# EAGLE design INA260_TB (EAGLE 8.0.0)
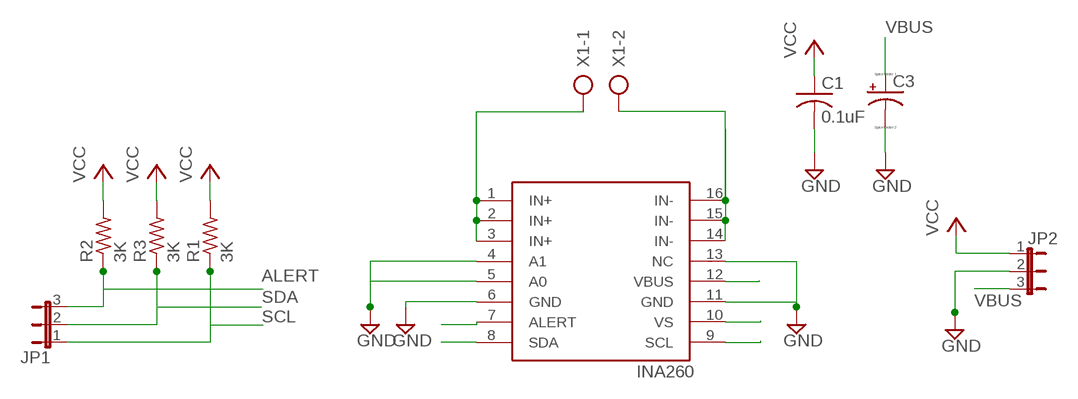
[diagram p0: schematic, sheet 1]

## Parts
C1  0.1uF  C-US050-025X075  [C050-025X075]
C3  CPOL-USE5-10.5  [E5-10,5]
JP1  JP2E  [JP2]
JP2  JP2E  [JP2]
R1  3K  R-US_0207/10  [0207/10]
R2  3K  R-US_0207/10  [0207/10]
R3  3K  R-US_0207/10  [0207/10]
U$1  INA260  [TSSOP16]
X1  AK300/2  [AK300/2]

## Nets
ALERT: JP1.3 R2.1 U$1.7(ALERT)
GND: C1.2 C3.- JP2.2 U$1.4(A1) U$1.5(A0) U$1.6(GND) U$1.11(GND) U$1.13(NC)
N$1: U$1.1(IN+) U$1.2(IN+) U$1.3(IN+) X1.1
N$2: U$1.14(IN-) U$1.15(IN-) U$1.16(IN-) X1.2
SCL: JP1.1 R1.1 U$1.9(SCL)
SDA: JP1.2 R3.1 U$1.8(SDA)
VBUS: C3.+ JP2.3 U$1.12(VBUS)
VCC: C1.1 JP2.1 R1.2 R2.2 R3.2 U$1.10(VS)

## Library data of the parts
C1 = resistor:C-US: CAPACITOR, American symbol
C3 = resistor:CPOL-US: POLARIZED CAPACITOR, American symbol
JP1 JP2 = jumper:JP2E: JUMPER
R1-R3 = rcl:R-US_: RESISTOR, American symbol
U$1 = INA260:INA260: High/Low-Side Digital Current/Power Monitor with Integrated 2mΩ Shunt Resistor http://www.ti.com/product/INA260/description; MANUFACTURER: Texas Instruments
X1 = con-ptr500:AK300/2: CONNECTOR; OC_FARNELL: unknown; OC_NEWARK: unknown

## Net classes
0 default: width 0.406 mm, drill 0.762 mm, clearance 0.406 mm

## Board
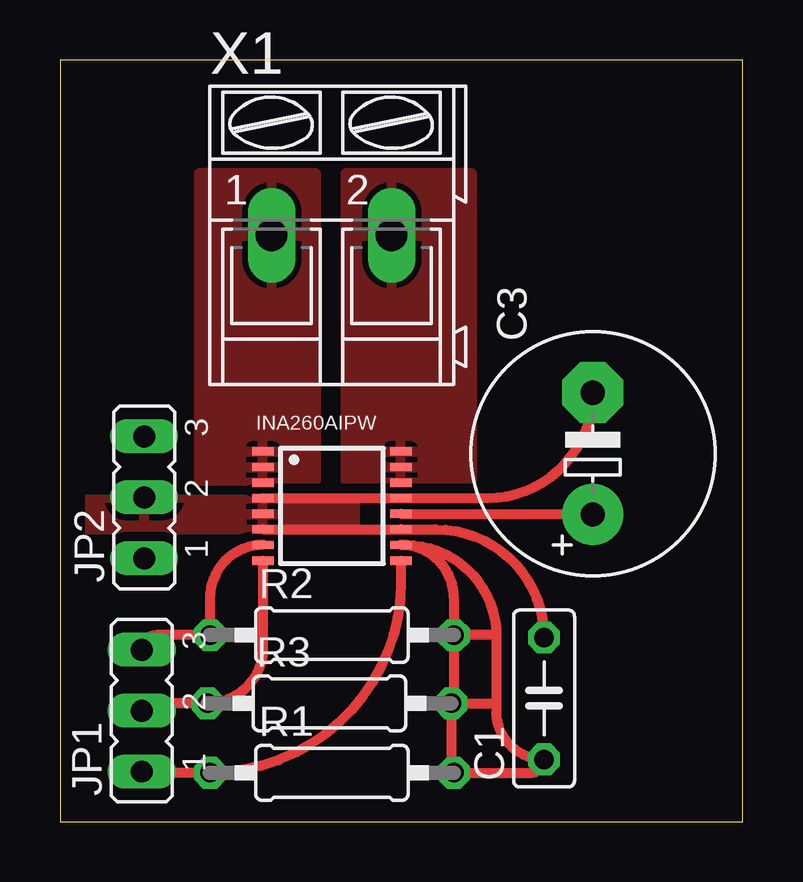
[diagram p1: board, top side]
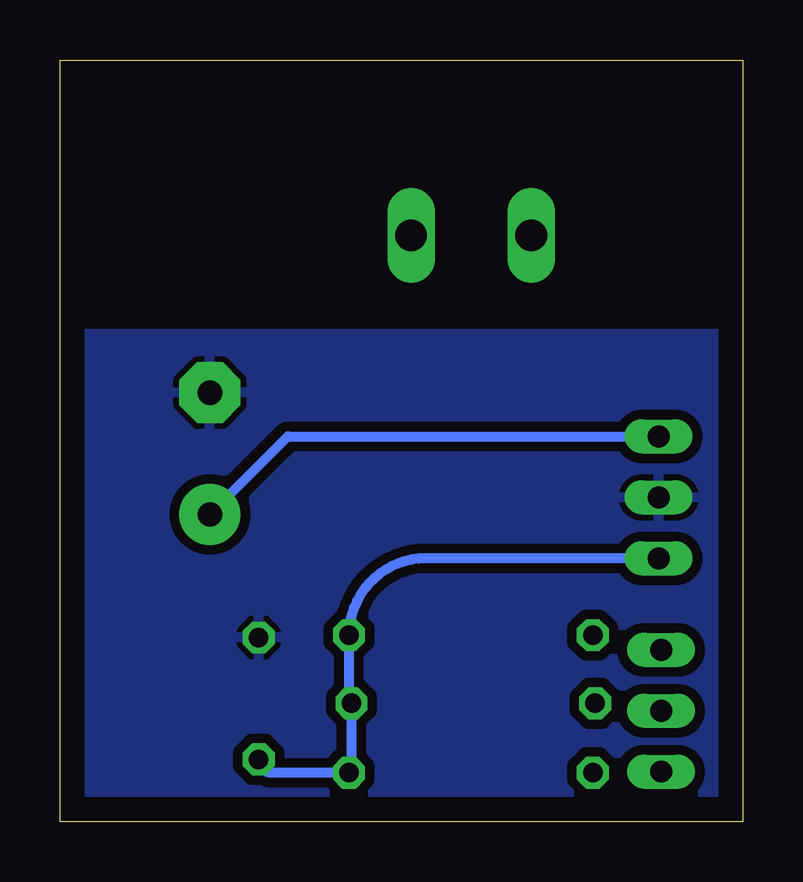
[diagram p2: board, bottom side, seen from below]

Size 28.45 x 31.75 mm. Coordinates in mm from the lower left corner, seen from the top.
Outline: 0,0 28.45,0 28.45,31.75 0,31.75 0,0
Copper layers (1*16): Top 0.035mm / dielectric 1.5mm / Bottom 0.035mm
Design rules "default": minimum track width 10mil, minimum drill 24mil, track to track 8mil, track to pad 8mil, pad to pad 8mil, via to via 8mil, smd to smd 8mil, copper to edge 40mil, drill to drill 8mil, minimum pad ring 10mil, minimum via ring 8mil, stop-mask expansion 4mil, vias tented up to drill 0mil, thermal gap 10mil

### Footprints (pad centres in the part's own frame; a part is rotated, then mirrored left to right if it is on the bottom)
C050-025X075 = drill 0.813 octagon: 1 -2.54,0; 2 2.54,0
E5-10,5 = drill 1.016 pad 2.54: + -2.54,0 | drill 1.016 pad 2.54 octagon: - 2.54,0
JP2 = drill 0.914 long: 1 -2.54,0; 2 0,0; 3 2.54,0
0207/10 = drill 0.813 octagon: 1 -5.08,0; 2 5.08,0
TSSOP16 = smd 0.9 x 0.35: 1 -2.875,2.275; 2 -2.875,1.625; 3 -2.875,0.975; 4 -2.875,0.325; 5 -2.875,-0.325; 6 -2.875,-0.975; 7 -2.875,-1.625; 8 -2.875,-2.275; 9 2.875,-2.275; 10 2.875,-1.625; 11 2.875,-0.975; 12 2.875,-0.325; 13 2.875,0.325; 14 2.875,0.975; 15 2.875,1.625; 16 2.875,2.275
AK300/2 = drill 1.321 long: 1 -2.515,0; 2 2.489,0

### Placement (x,y rotation side)
C1  20.17,5.13 90 top
C3  22.2,15.34 90 top
JP1  3.4,4.62 90 top
JP2  3.51,13.51 90 top
R1  11.33,2.03 0 top
R2  11.33,7.77 0 top
R3  11.23,4.93 0 top
U$1  11.33,13.16 0 top
X1  11.33,24.43 0 top

### Tracks (layer width: path | path; a pad name or v marks a point on that pad's centre or on a via)
ALERT
  Top 0.406: JP1.3 arc-90 4.01,7.77 R2.1 6.25,9.33 arc-90 U$1.7
GND
  Top 0.406: U$1.4 U$1.13 17.8,13.48 arc90 C3.- | U$1.6 U$1.11 15.66,12.18 arc-90 C1.2
  pour Top: 12.29,13.41 -0.1,13.41 -0.1,12.19 12.29,12.19
  pour Bottom: -0.51,20.32 28.35,20.32 28.35,-1.22 -0.51,-1.22
N$1
  pour Top: 10.67,27.03 5.79,27.03 5.79,14.22 10.67,14.22
N$2
  pour Top: 11.89,14.22 17.17,14.22 17.17,27.03 11.89,27.03
SCL
  Top 0.406: JP1.1 arc90 3.45,2.03 R1.1 arc90 14.2,9.99 U$1.9
SDA
  Top 0.406: JP1.2 arc-90 3.71,4.93 R3.1 arc90 8.45,7.23 U$1.8
VBUS
  Top 0.406: U$1.12 22.17,12.83 arc-90 C3.+
  Bottom 0.406: C3.+ 18.95,16.05 JP2.3
VCC
  Top 0.406: 16.51,7.67 R2.2 | R2.2 16.41,5.03 R3.2 | R3.2 16.31,2.13 R1.2 19.61,2.03 arc90 C1.1 arc-90 18.19,4.57 18.19,4.88 | U$1.10 arc-90 16.41,9.33 R2.2 | 18.19,7.72 18.19,4.88 | R2.2 18.14,7.77 arc-90 18.19,7.72 | R3.2 18.14,4.93 arc-90 18.19,4.88 | U$1.10 14.38,11.53 | U$1.10 14.38,11.53 | 14.38,11.53 arc-90 18.19,7.72
  Bottom 0.406: JP2.1 13.21,10.97 arc-90 R2.2 16.41,5.03 arc-90 R3.2 16.31,2.13 arc90 R1.2 19.61,2.03 arc90 C1.1